# EAGLE schematic input-breakout (EAGLE 9.1.1)
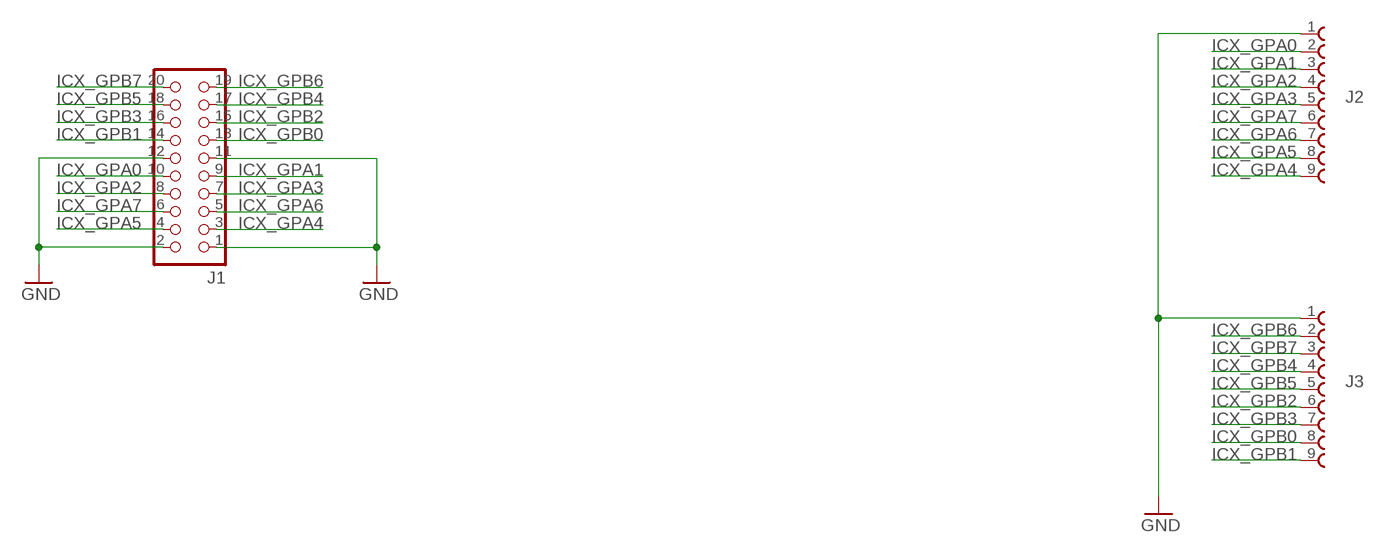
[diagram p0: schematic, sheet 1]

## Parts
J1  CON_HEADER_2X10-SHROUDED  [PINSHRD_PTH_2X10]
J2  69132211000_XX  [69132211000_XX]
J3  69132211000_XX  [69132211000_XX]

## Nets
GND: J1.1 J1.2 J1.11 J1.12 J2.1 J3.1
ICX_GPA0: J1.10 J2.2
ICX_GPA1: J1.9 J2.3
ICX_GPA2: J1.8 J2.4
ICX_GPA3: J1.7 J2.5
ICX_GPA4: J1.3 J2.9
ICX_GPA5: J1.4 J2.8
ICX_GPA6: J1.5 J2.7
ICX_GPA7: J1.6 J2.6
ICX_GPB0: J1.13 J3.8
ICX_GPB1: J1.14 J3.9
ICX_GPB2: J1.15 J3.6
ICX_GPB3: J1.16 J3.7
ICX_GPB4: J1.17 J3.4
ICX_GPB5: J1.18 J3.5
ICX_GPB6: J1.19 J3.2
ICX_GPB7: J1.20 J3.3

## Library data of the parts
J1 = dp_devices:CON_HEADER_2X10
J2 J3 = dadamachines:69132211000_XX: Terminal block - 9 Pins;